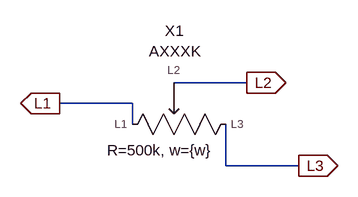
[diagram p0: schematic A500K.asc]
A500K.asc, the LTspice schematic file:
Version 4
SHEET 1 880 680
WIRE 160 176 48 176
WIRE -16 208 -128 208
WIRE -16 240 -16 208
WIRE 128 304 128 240
WIRE 240 304 128 304
FLAG 160 176 L2
IOPIN 160 176 Out
FLAG -128 208 L1
IOPIN -128 208 Out
FLAG 240 304 L3
IOPIN 240 304 Out
SYMBOL Base_AxxxK 48 176 R0
WINDOW 39 -22 104 Center 2
SYMATTR InstName X1
SYMATTR SpiceLine R=500k, w={w}

The netlist it stands for:
* A500K.asc
XX1 L1 L2 L3 AXXXK R=500k, w={w}  ; pins L1 L2 L3
.backanno
.end